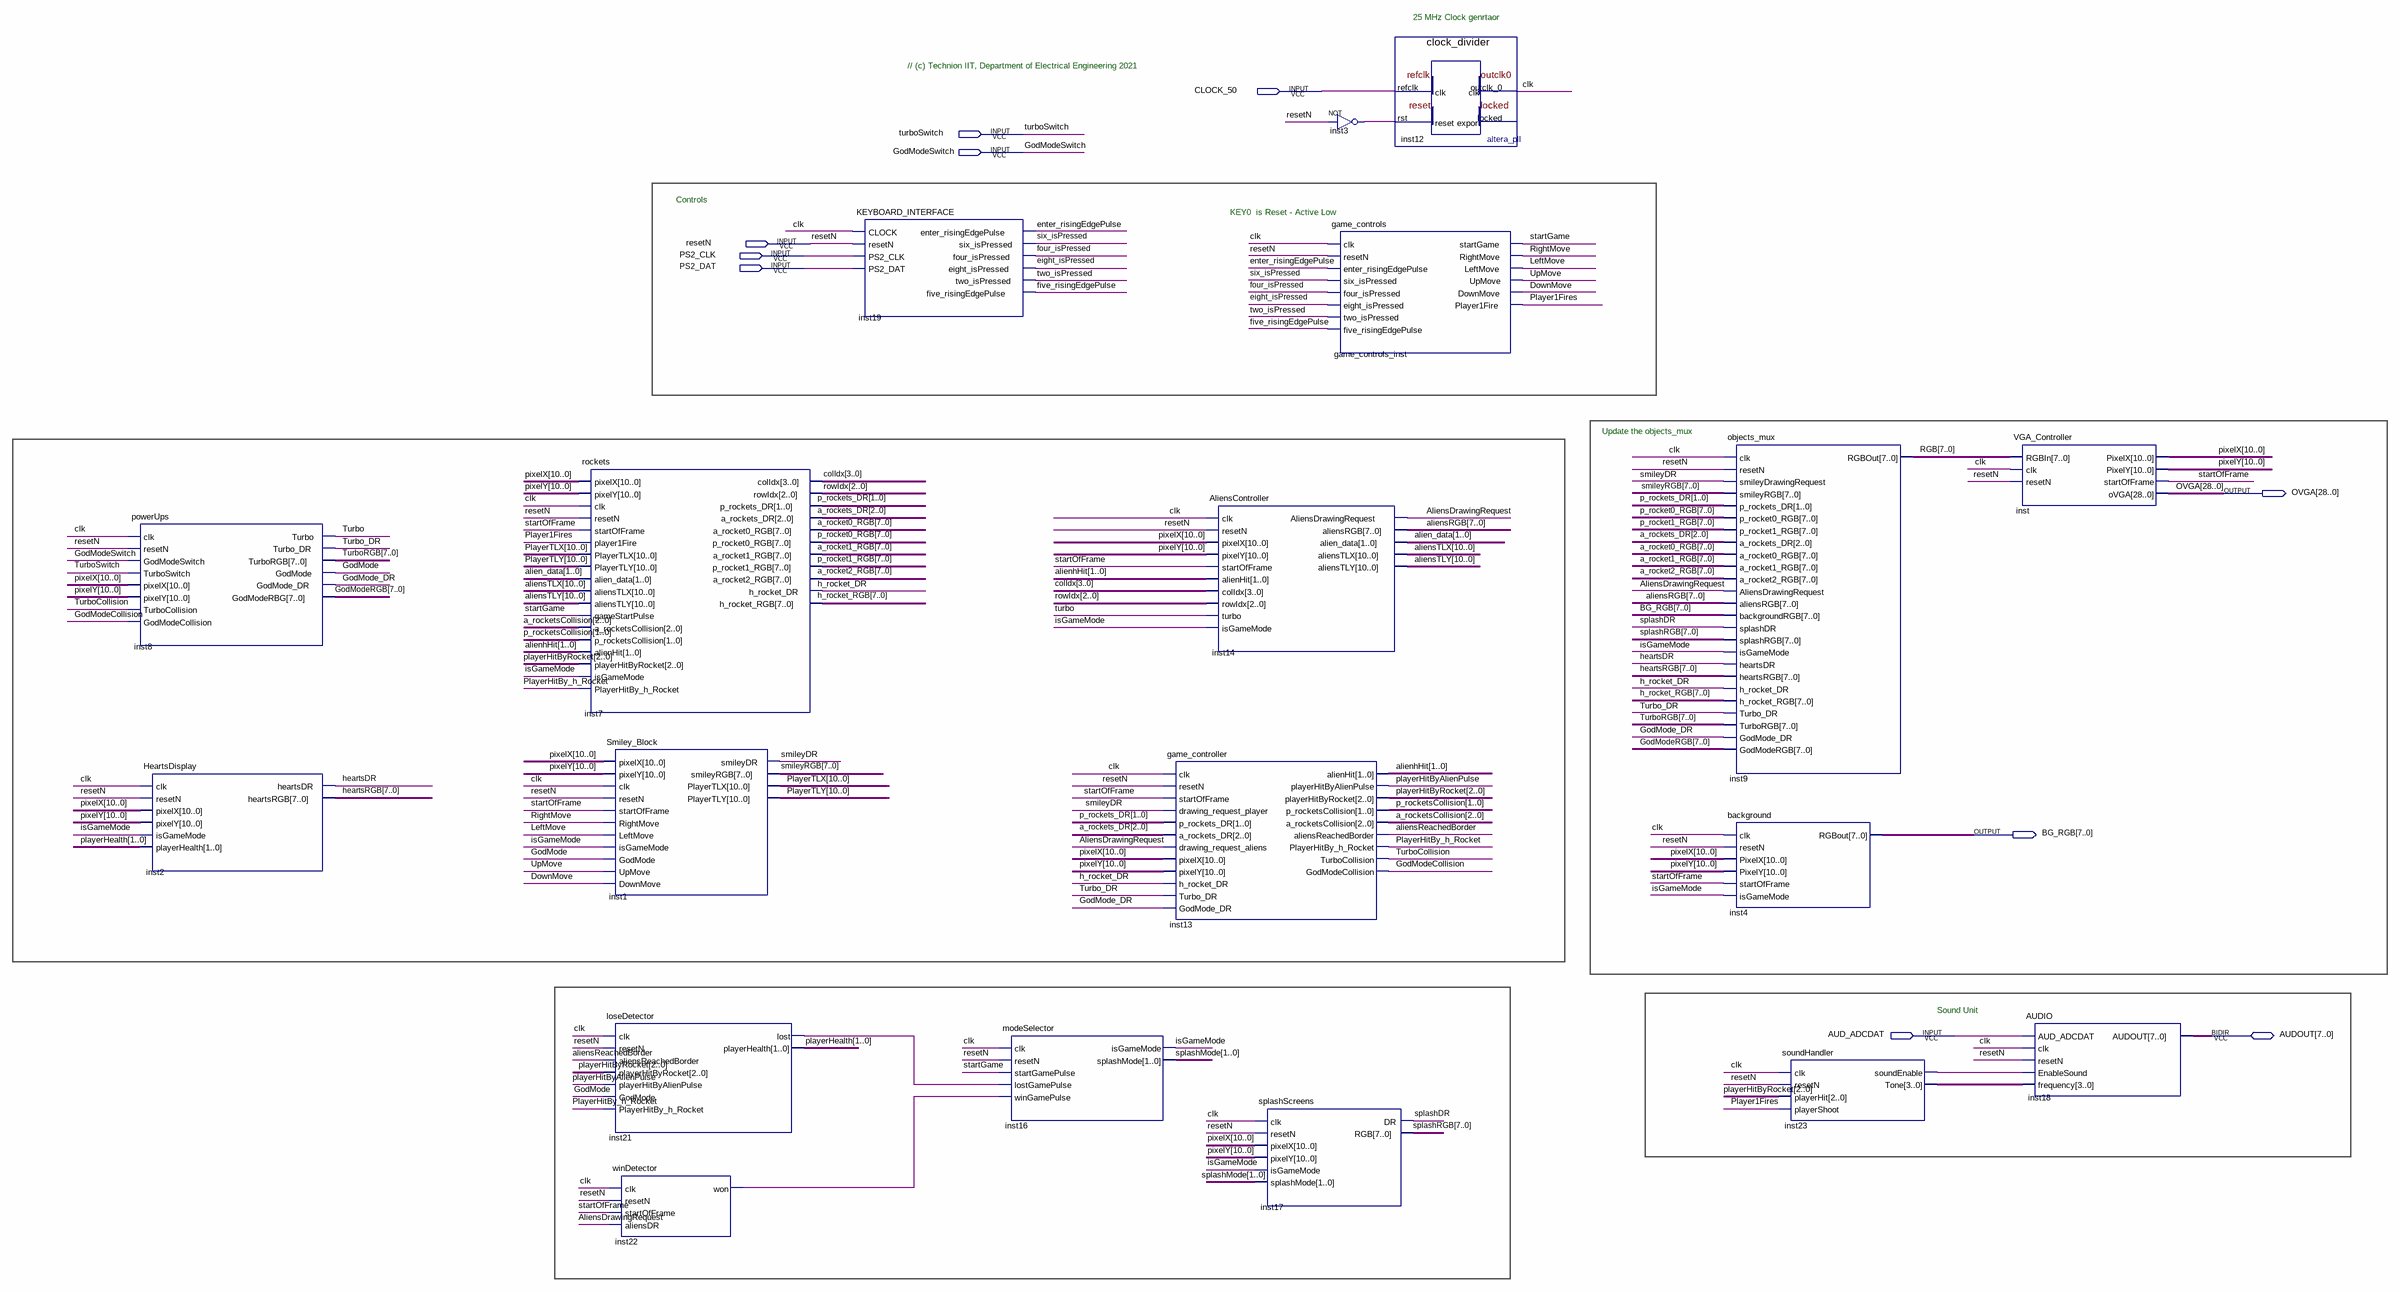
[diagram p0: schematic sheet]
// Quartus schematic TOP_VGA_DEMO_KBD.bdf as structural Verilog: 19 symbols, 10 pins
module TOP_VGA_DEMO_KBD (
  input  CLOCK_50,
  input  turboSwitch,
  input  GodModeSwitch,
  input  resetN,
  input  PS2_CLK,
  input  PS2_DAT,
  input  AUD_ADCDAT,
  inout  [7:0] AUDOUT,
  output [28:0] OVGA,
  output [7:0] BG_RGB
);

  wire AliensDrawingRequest, aliensReachedBorder, clk, DownMove, eight_isPressed, enter_risingEdgePulse,
       five_risingEdgePulse, four_isPressed, GodMode, GodMode_DR, GodModeCollision, h_rocket_DR, heartsDR,
       inst3_out, inst21_lost, inst22_won, inst23_soundenable, isGameMode, LeftMove, Player1Fires,
       PlayerHitBy_h_Rocket, playerHitByAlienPulse, RightMove, six_isPressed, smileyDR, splashDR, startGame,
       startOfFrame, Turbo, Turbo_DR, TurboCollision, two_isPressed, UpMove;
  wire [1:0] alien_data, alienhHit, p_rockets_DR, p_rocketsCollision, playerHealth, splashMode;
  wire [2:0] a_rockets_DR, a_rocketsCollision, playerHitByRocket, rowIdx;
  wire [3:0] colIdx, inst23_tone;
  wire [7:0] a_rocket0_RGB, a_rocket1_RGB, a_rocket2_RGB, aliensRGB, GodModeRGB, h_rocket_RGB, heartsRGB,
       p_rocket0_RGB, p_rocket1_RGB, RGB, smileyRGB, splashRGB, TurboRGB;
  wire [10:0] aliensTLX, aliensTLY, pixelX, pixelY, PlayerTLX, PlayerTLY;

  powerUps inst8 (
    .clk(clk), .resetN(resetN), .GodModeSwitch(GodModeSwitch), .TurboSwitch(turboSwitch), .pixelX(pixelX),
    .pixelY(pixelY), .TurboCollision(TurboCollision), .GodModeCollision(GodModeCollision), .Turbo(Turbo),
    .Turbo_DR(Turbo_DR), .TurboRGB(TurboRGB), .GodMode(GodMode), .GodMode_DR(GodMode_DR),
    .GodModeRBG(GodModeRGB));
  HeartsDisplay inst2 (
    .clk(clk), .resetN(resetN), .pixelX(pixelX), .pixelY(pixelY), .isGameMode(isGameMode),
    .playerHealth(playerHealth), .heartsDR(heartsDR), .heartsRGB(heartsRGB));
  rockets inst7 (
    .pixelX(pixelX), .pixelY(pixelY), .clk(clk), .resetN(resetN), .startOfFrame(startOfFrame),
    .player1Fire(Player1Fires), .PlayerTLX(PlayerTLX), .PlayerTLY(PlayerTLY), .alien_data(alien_data),
    .aliensTLX(aliensTLX), .aliensTLY(aliensTLY), .gameStartPulse(startGame),
    .a_rocketsCollision(a_rocketsCollision), .p_rocketsCollision(p_rocketsCollision), .alienHit(alienhHit),
    .playerHitByRocket(playerHitByRocket), .isGameMode(isGameMode),
    .PlayerHitBy_h_Rocket(PlayerHitBy_h_Rocket), .colIdx(colIdx), .rowIdx(rowIdx),
    .p_rockets_DR(p_rockets_DR), .a_rockets_DR(a_rockets_DR), .a_rocket0_RGB(a_rocket0_RGB),
    .p_rocket0_RGB(p_rocket0_RGB), .a_rocket1_RGB(a_rocket1_RGB), .p_rocket1_RGB(p_rocket1_RGB),
    .a_rocket2_RGB(a_rocket2_RGB), .h_rocket_DR(h_rocket_DR), .h_rocket_RGB(h_rocket_RGB));
  Smiley_Block inst1 (
    .pixelX(pixelX), .pixelY(pixelY), .clk(clk), .resetN(resetN), .startOfFrame(startOfFrame),
    .RightMove(RightMove), .LeftMove(LeftMove), .isGameMode(isGameMode), .GodMode(GodMode), .UpMove(UpMove),
    .DownMove(DownMove), .smileyDR(smileyDR), .smileyRGB(smileyRGB), .PlayerTLX(PlayerTLX),
    .PlayerTLY(PlayerTLY));
  loseDetector inst21 (
    .clk(clk), .resetN(resetN), .aliensReachedBorder(aliensReachedBorder),
    .playerHitByRocket(playerHitByRocket), .playerHitByAlienPulse(playerHitByAlienPulse), .GodMode(GodMode),
    .PlayerHitBy_h_Rocket(PlayerHitBy_h_Rocket), .lost(inst21_lost), .playerHealth(playerHealth));
  winDetector inst22 (
    .clk(clk), .resetN(resetN), .startOfFrame(startOfFrame), .aliensDR(AliensDrawingRequest), .won(inst22_won));
  KEYBOARD_INTERFACE inst19 (
    .CLOCK(clk), .resetN(resetN), .PS2_CLK(PS2_CLK), .PS2_DAT(PS2_DAT),
    .enter_risingEdgePulse(enter_risingEdgePulse), .six_isPressed(six_isPressed),
    .four_isPressed(four_isPressed), .eight_isPressed(eight_isPressed), .two_isPressed(two_isPressed),
    .five_risingEdgePulse(five_risingEdgePulse));
  modeSelector inst16 (
    .clk(clk), .resetN(resetN), .startGamePulse(startGame), .lostGamePulse(inst21_lost),
    .winGamePulse(inst22_won), .isGameMode(isGameMode), .splashMode(splashMode));
  game_controller inst13 (
    .clk(clk), .resetN(resetN), .startOfFrame(startOfFrame), .drawing_request_player(smileyDR),
    .p_rockets_DR(p_rockets_DR), .a_rockets_DR(a_rockets_DR), .drawing_request_aliens(AliensDrawingRequest),
    .pixelX(pixelX), .pixelY(pixelY), .h_rocket_DR(h_rocket_DR), .Turbo_DR(Turbo_DR),
    .GodMode_DR(GodMode_DR), .alienHit(alienhHit), .playerHitByAlienPulse(playerHitByAlienPulse),
    .playerHitByRocket(playerHitByRocket), .p_rocketsCollision(p_rocketsCollision),
    .a_rocketsCollision(a_rocketsCollision), .aliensReachedBorder(aliensReachedBorder),
    .PlayerHitBy_h_Rocket(PlayerHitBy_h_Rocket), .TurboCollision(TurboCollision),
    .GodModeCollision(GodModeCollision));
  AliensController inst14 (
    .clk(clk), .resetN(resetN), .pixelX(pixelX), .pixelY(pixelY), .startOfFrame(startOfFrame),
    .alienHit(alienhHit), .colIdx(colIdx), .rowIdx(rowIdx), .turbo(Turbo), .isGameMode(isGameMode),
    .AliensDrawingRequest(AliensDrawingRequest), .aliensRGB(aliensRGB), .alien_data(alien_data),
    .aliensTLX(aliensTLX), .aliensTLY(aliensTLY));
  splashScreens inst17 (
    .clk(clk), .resetN(resetN), .pixelX(pixelX), .pixelY(pixelY), .isGameMode(isGameMode),
    .splashMode(splashMode), .DR(splashDR), .RGB(splashRGB));
  not inst3 (inst3_out, resetN);
  game_controls game_controls_inst (
    .clk(clk), .resetN(resetN), .enter_risingEdgePulse(enter_risingEdgePulse), .six_isPressed(six_isPressed),
    .four_isPressed(four_isPressed), .eight_isPressed(eight_isPressed), .two_isPressed(two_isPressed),
    .five_risingEdgePulse(five_risingEdgePulse), .startGame(startGame), .RightMove(RightMove),
    .LeftMove(LeftMove), .UpMove(UpMove), .DownMove(DownMove), .Player1Fire(Player1Fires));
  clock_divider inst12 (.refclk(CLOCK_50), .rst(inst3_out), .outclk_0(clk));  // open: locked
  objects_mux inst9 (
    .clk(clk), .resetN(resetN), .smileyDrawingRequest(smileyDR), .smileyRGB(smileyRGB),
    .p_rockets_DR(p_rockets_DR), .p_rocket0_RGB(p_rocket0_RGB), .p_rocket1_RGB(p_rocket1_RGB),
    .a_rockets_DR(a_rockets_DR), .a_rocket0_RGB(a_rocket0_RGB), .a_rocket1_RGB(a_rocket1_RGB),
    .a_rocket2_RGB(a_rocket2_RGB), .AliensDrawingRequest(AliensDrawingRequest), .aliensRGB(aliensRGB),
    .backgroundRGB(BG_RGB), .splashDR(splashDR), .splashRGB(splashRGB), .isGameMode(isGameMode),
    .heartsDR(heartsDR), .heartsRGB(heartsRGB), .h_rocket_DR(h_rocket_DR), .h_rocket_RGB(h_rocket_RGB),
    .Turbo_DR(Turbo_DR), .TurboRGB(TurboRGB), .GodMode_DR(GodMode_DR), .GodModeRGB(GodModeRGB), .RGBOut(RGB));
  background inst4 (
    .clk(clk), .resetN(resetN), .PixelX(pixelX), .PixelY(pixelY), .startOfFrame(startOfFrame),
    .isGameMode(isGameMode), .RGBout(BG_RGB));
  soundHandler inst23 (
    .clk(clk), .resetN(resetN), .playerHit(playerHitByRocket), .playerShoot(Player1Fires),
    .soundEnable(inst23_soundenable), .Tone(inst23_tone));
  VGA_Controller inst (
    .RGBIn(RGB), .clk(clk), .resetN(resetN), .PixelX(pixelX), .PixelY(pixelY), .startOfFrame(startOfFrame),
    .oVGA(OVGA));
  AUDIO inst18 (
    .AUD_ADCDAT(AUD_ADCDAT), .clk(clk), .resetN(resetN), .EnableSound(inst23_soundenable),
    .frequency(inst23_tone), .AUDOUT(AUDOUT));

  // Notes on the sheet:
  //   25 MHz Clock genrtaor
  //   // (c) Technion IIT, Department of Electrical Engineering 2021
  //   Controls
  //   KEY0  is Reset - Active Low
  //   Update the objects_mux
  //   Sound Unit
endmodule
